# EasyEDA schematic ramu.json
TITLE: Sheet_1; REV: 1.0; Date: 2026-04-19; Sheet: 1/1; Company: Your Company
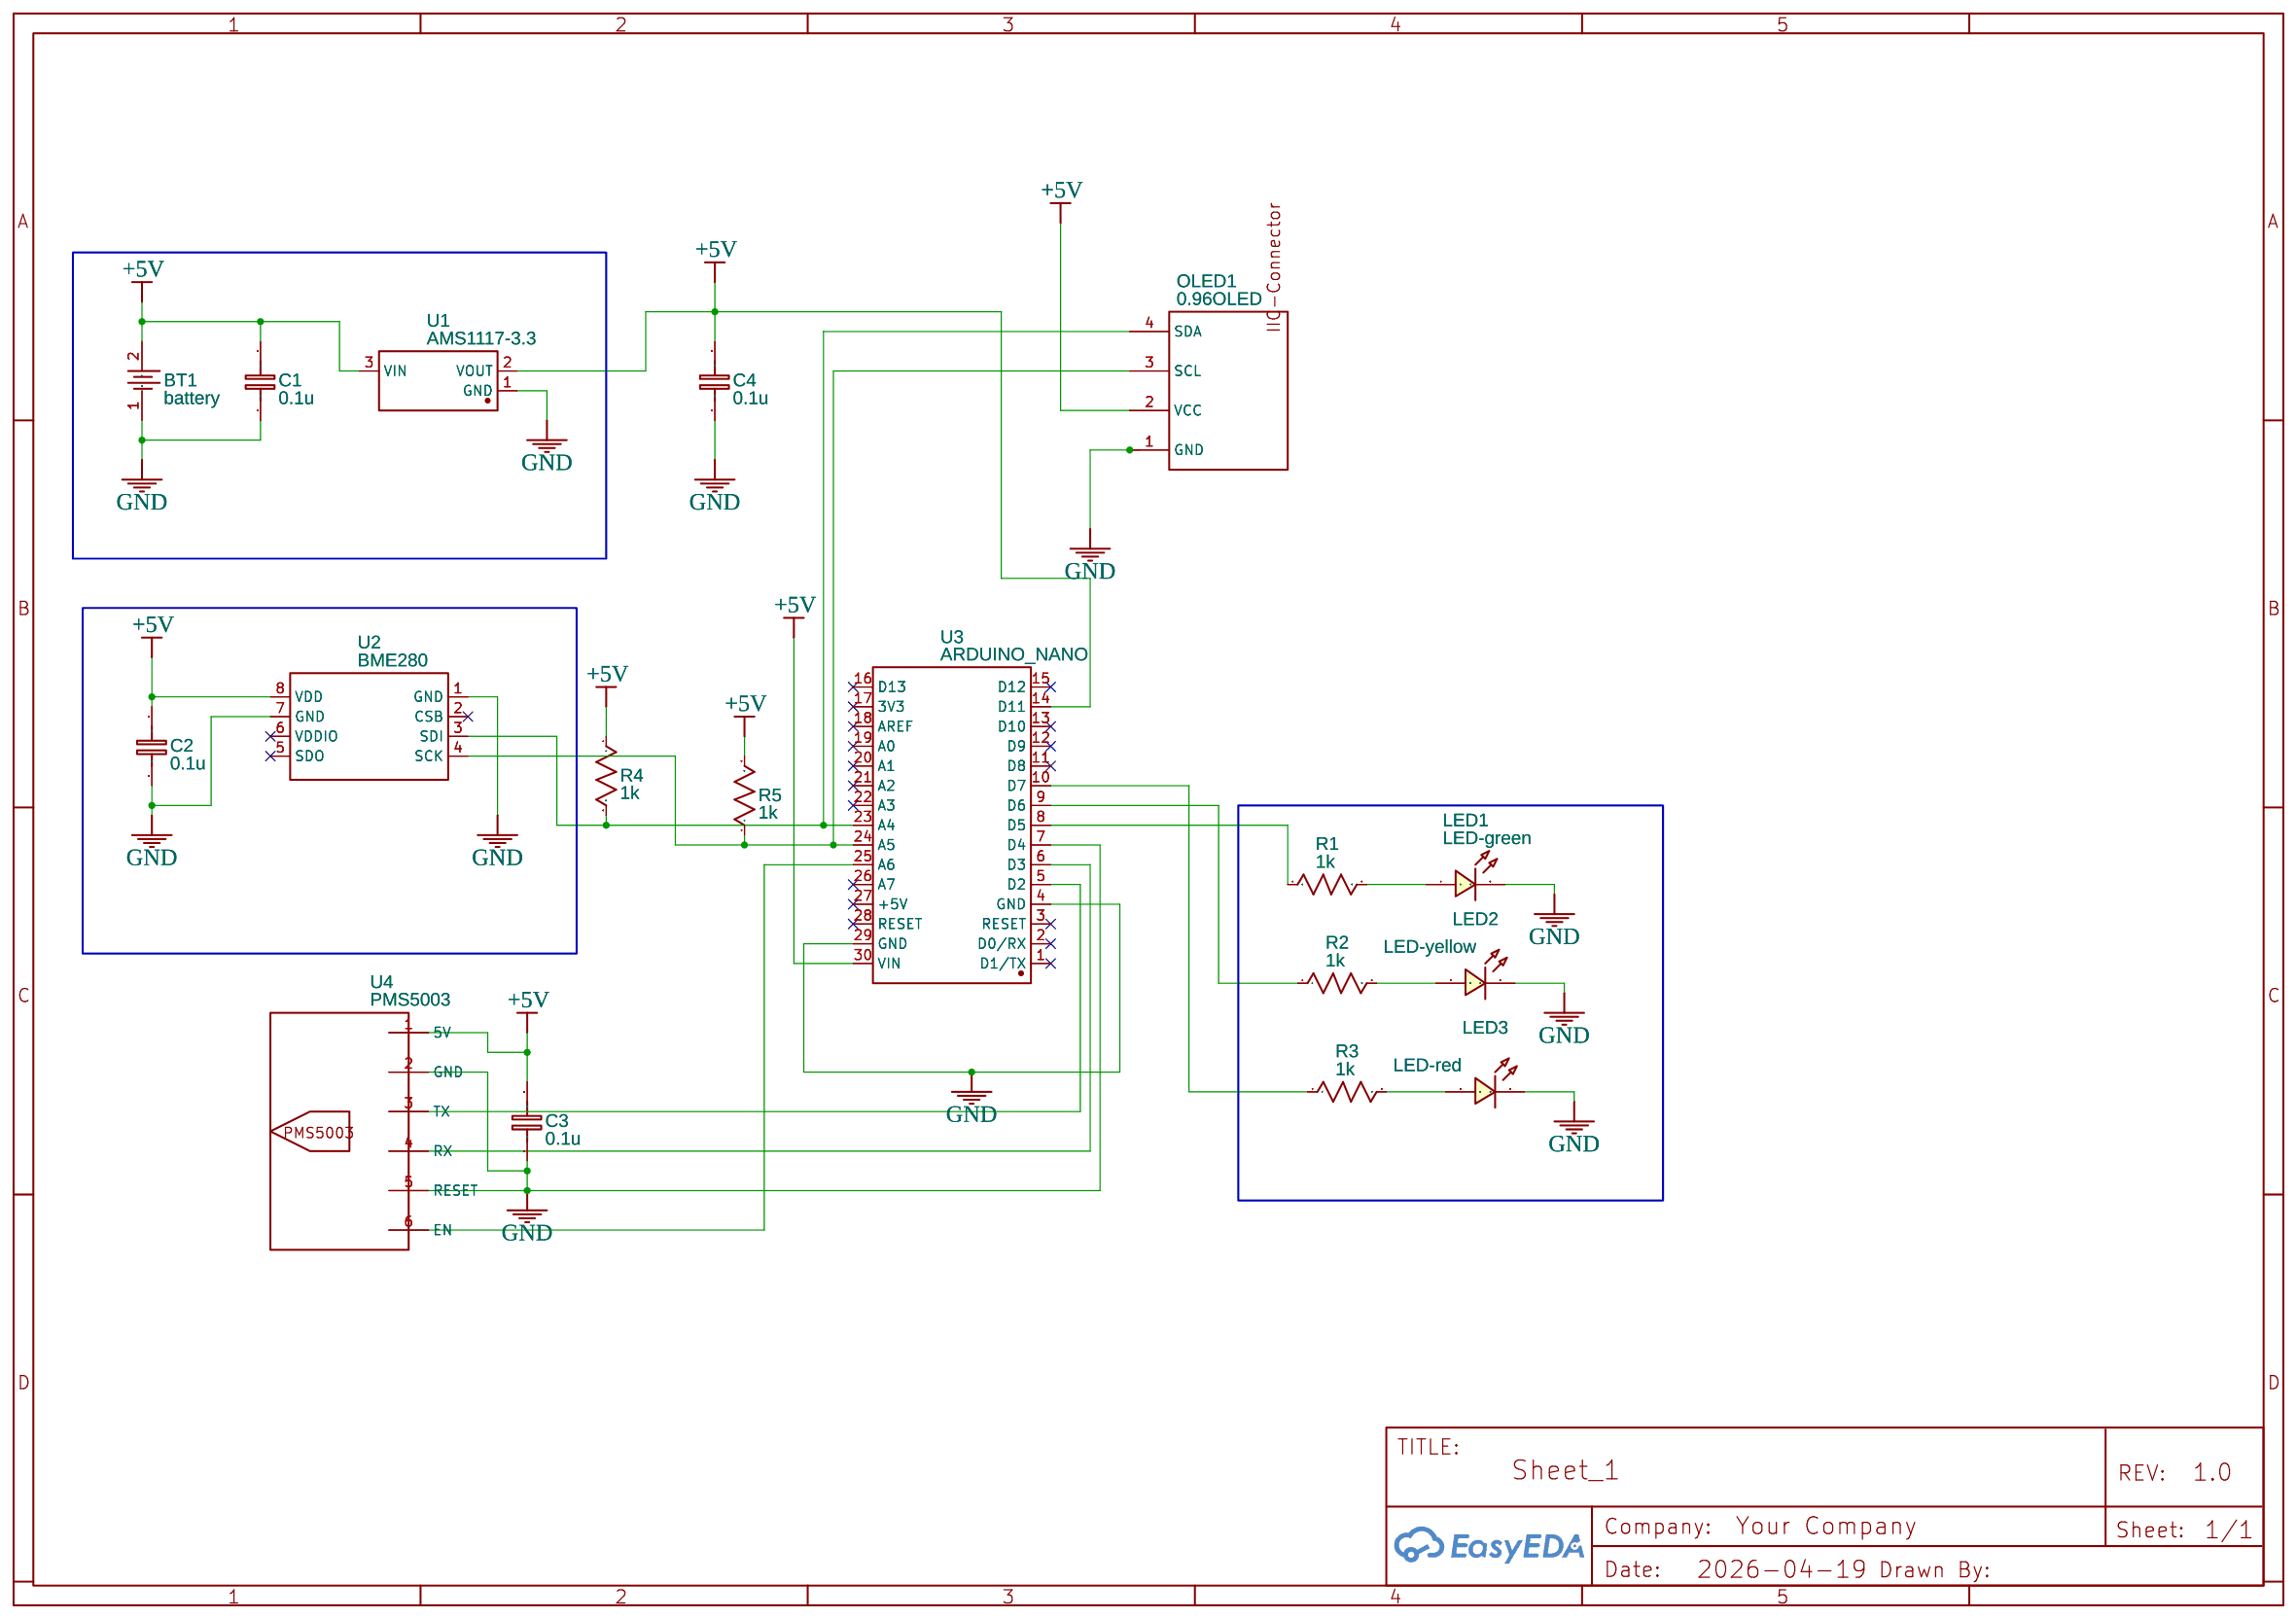
[diagram p0: schematic sheet]

## Parts
BT1  battery  [BATTERY-SMD_18650-1S-L77.1-W20.7-1]
C1  0.1u  [C0603]
C2  0.1u  [C0603]
C3  0.1u  [C0603]
C4  0.1u  [C0603]
LED1  LED-green  [LED0603_RED]
LED2  LED-yellow  [LED0603_RED]
LED3  LED-red  [LED0603_RED]
OLED1  0.96OLED  [0.96OLED_4P]
R1  1k  [R0603]
R2  1k  [R0603]
R3  1k  [R0603]
R4  1k  [R0603]
R5  1k  [R0603]
U1  AMS1117-3.3  [SOT-89-3_L4.5-W2.4-P1.50-LS4.0-BR]
U2  BME280  [LGA-8_BME280_BL]
U3  ARDUINO_NANO  [COMM-TH_ARDUINO_NANO]
U4  PMS5003  [PMS5003]

## Library data of the parts
BT1 = BH-18650-B1BA002: Contributor: lcsc; Supplier: LCSC; Supplier Part: C2988620; Manufacturer: MYOUNG(美阳); JLCPCB Part Class: Extended Part
C1-C4 = C_0603_EU: Contributor: LCEDA_Lib
LED1-LED3 = LED-0603_R: Manufacturer: EVERLIGHT(台湾亿光); Manufacturer Part: 19-217/R6C-AL1M2VY/3T; Supplier Part: C72044; Supplier: LCSC; Contributor: LCEDA_01
OLED1 = 0.96OLED_4P_MODULE_JX: Contributor: LCSC; Supplier: LCSC; Supplier Part: C9900004566; Manufacturer: null; JLCPCB Part Class: Extended Part
R1-R5 = R_0603_US: Contributor: LCEDA_Lib
U1 = AMS1117-3.3S-EV: Supplier: LCSC; Supplier Part: C28642132; Manufacturer: null; JLCPCB Part Class: Extended Part; Contributor: lcsc
U2 = BME280: Contributor: LCSC; Supplier: LCSC; Manufacturer: Bosch(博世); Supplier Part: C92489; JLCPCB Part Class: Extended Part
U3 = ARDUINO_NANO: Contributor: lcsc; Supplier: LCSC; Supplier Part: C9900017879; Manufacturer: null; JLCPCB Part Class: Extended Part
U4 = PMS5003: Contributor: romanaspeekbloor

## Nets
+5V: BT1.2 C1.2 C2.2 C3.2 C4.2 OLED1.2(VCC) R4.1 R5.2 U1.2(VOUT) U1.3(VIN) U2.8(VDD) U3.14(D11) U3.30(VIN) U4.1(5V)
GND: BT1.1 C1.1 C2.1 C3.1 C4.1 LED1.2 LED2.2 LED3.2 OLED1.1(GND) U1.1(GND) U2.1(GND) U2.7(GND) U3.4(GND) U3.7(D4) U3.29(GND) U4.2(GND) U4.5(RESET)
Net-(LED1-1): LED1.1 R1.2
Net-(LED2-1): LED2.1 R2.2
Net-(LED3-1): LED3.1 R3.2
Net-(OLED1-3): OLED1.3(SCL) R5.1 U2.4(SCK) U3.24(A5)
Net-(OLED1-4): OLED1.4(SDA) R4.2 U2.3(SDI) U3.23(A4)
Net-(R1-1): R1.1 U3.8(D5)
Net-(R2-1): R2.1 U3.9(D6)
Net-(R3-1): R3.1 U3.10(D7)
Net-(U3-5): U3.5(D2) U4.3(TX)
Net-(U3-6): U3.6(D3) U4.4(RX)
Net-(U3-25): U3.25(A6) U4.6(EN)

Not connected (* = marked no-connect by the designer): U2 2(CSB)* 5(SDO)* 6(VDDIO)*; U3 1(D1/TX)* 2(D0/RX)* 3(RESET)* 11(D8)* 12(D9)* 13(D10)* 15(D12)* 16(D13)* 17(3V3)* 18(AREF)* 19(A0)* 20(A1)* 21(A2)* 22(A3)* 26(A7)* 27(+5V)* 28(RESET)*
